# EAGLE design trig4_board (EAGLE 9.2.0)
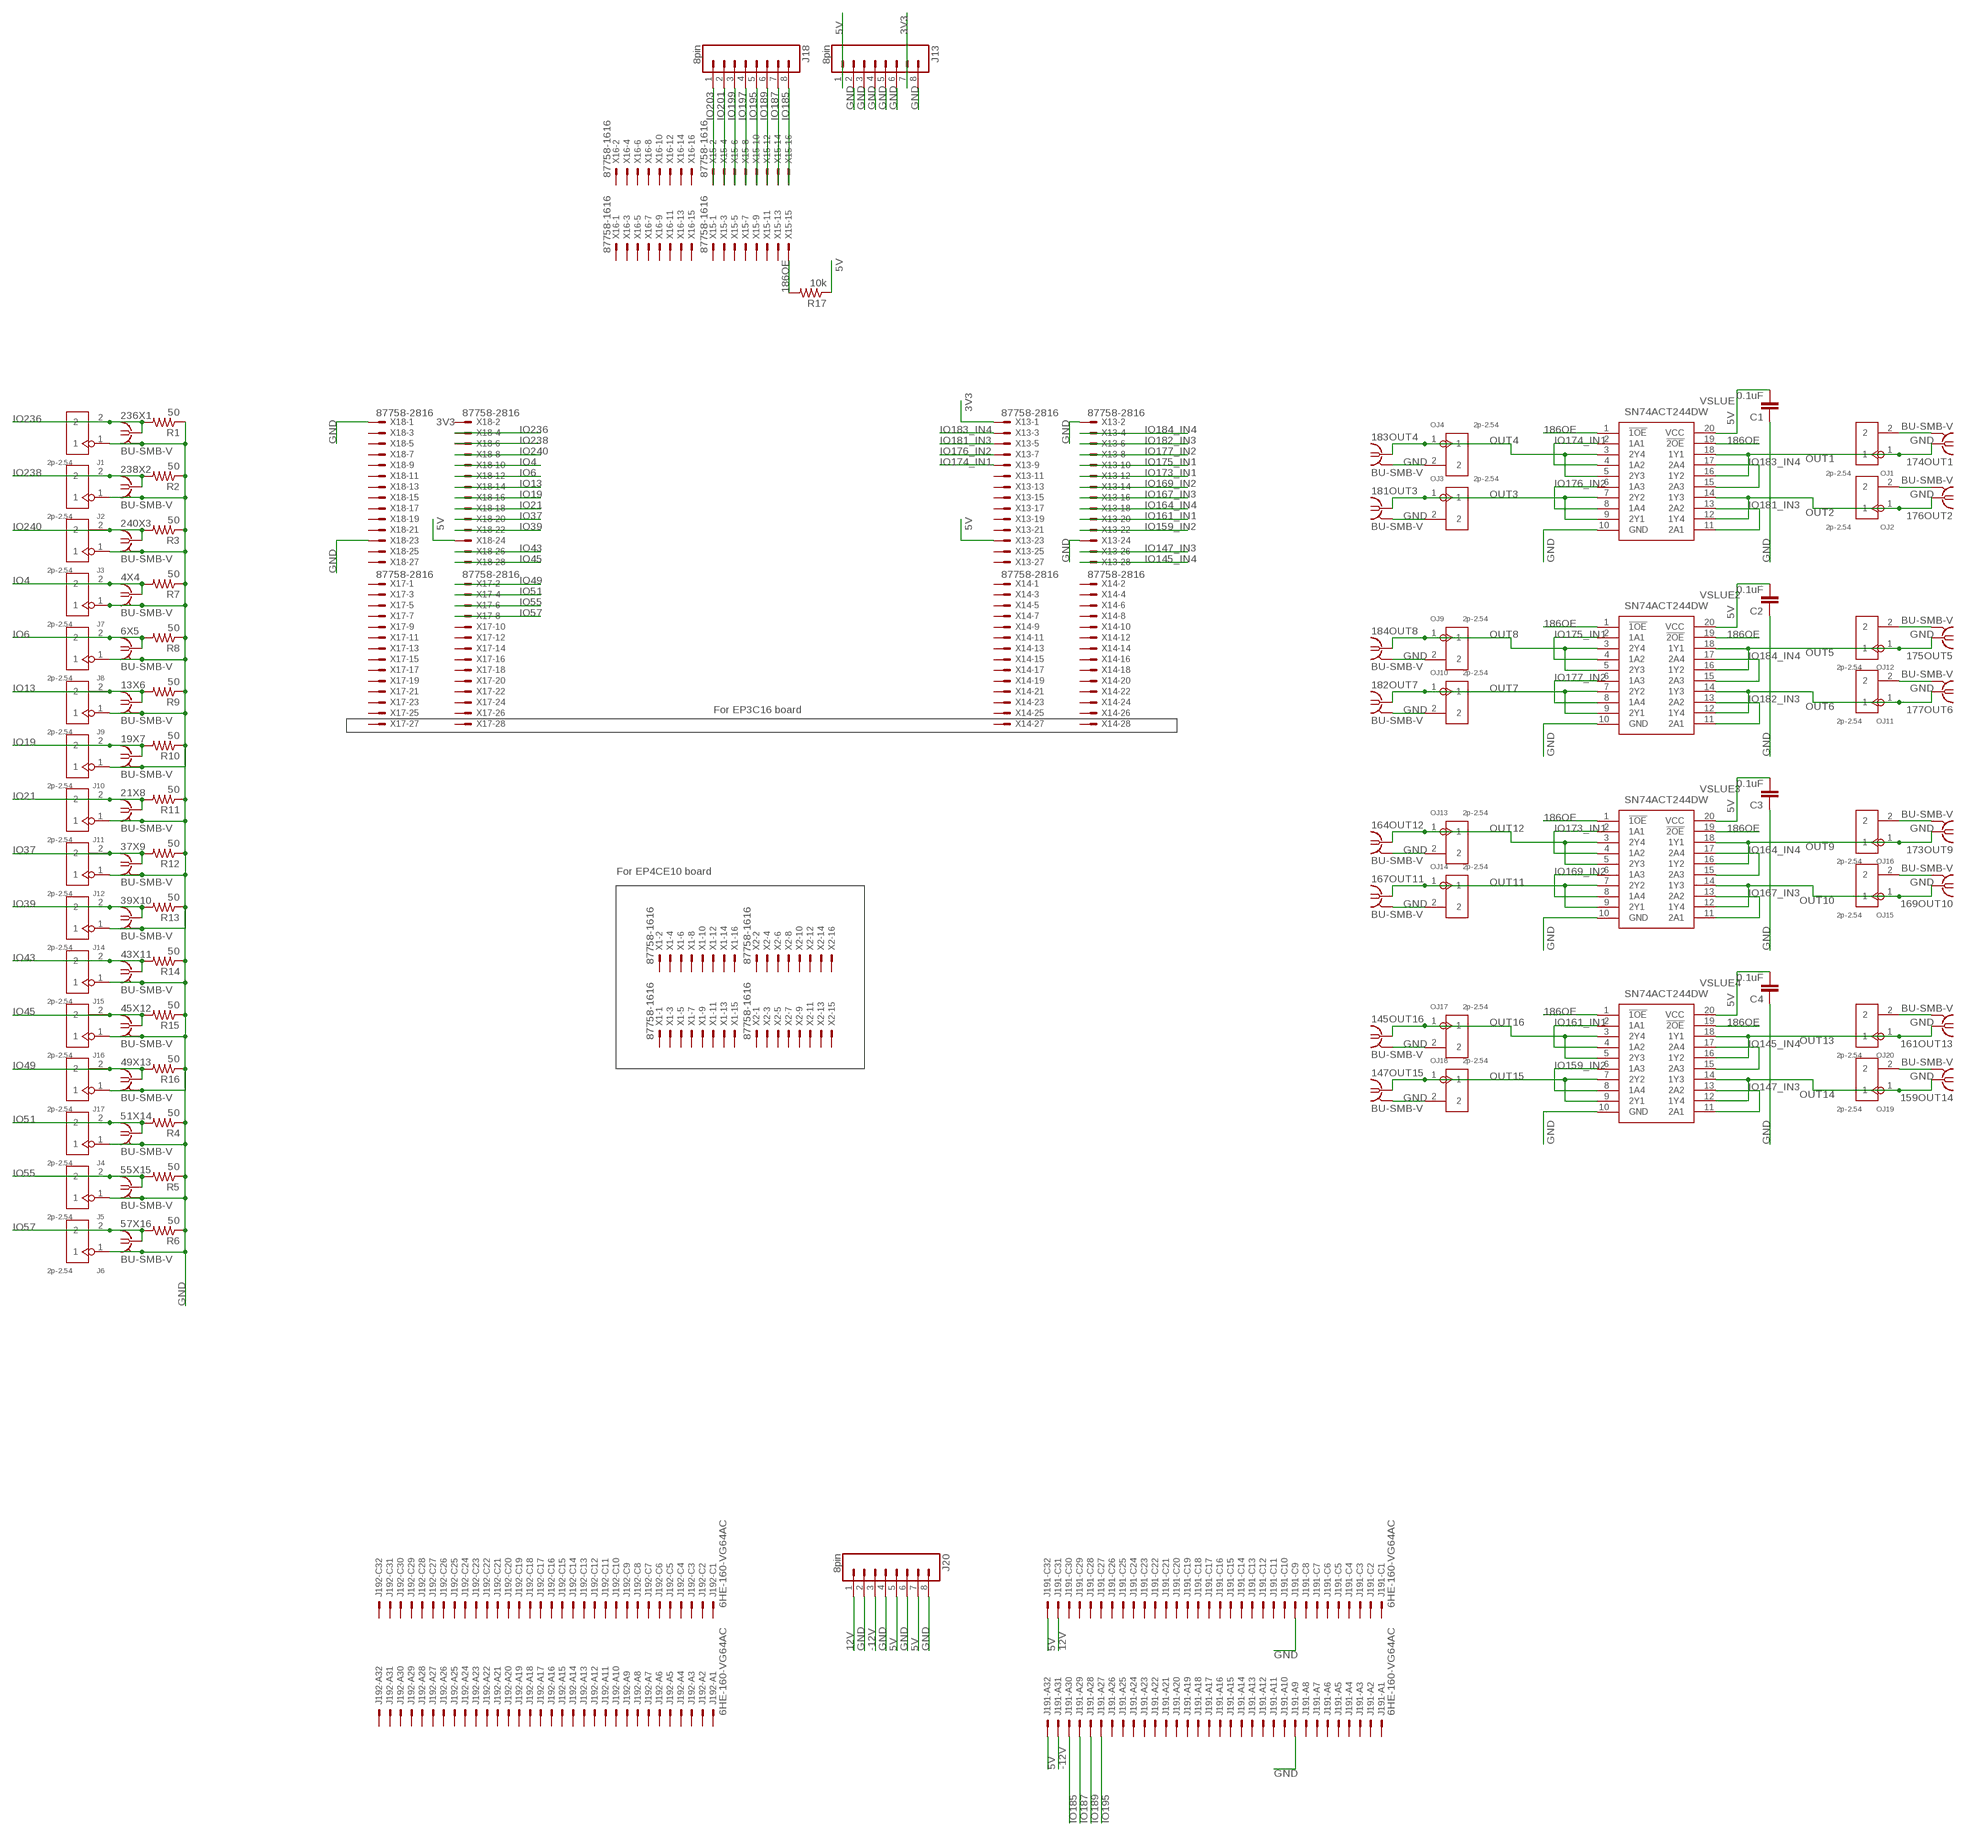
[diagram p0: schematic, sheet 1]

## Parts
4X4  BU-SMB-V  [BU-SMB-V]
6X5  BU-SMB-V  [BU-SMB-V]
13X6  BU-SMB-V  [BU-SMB-V]
19X7  BU-SMB-V  [BU-SMB-V]
21X8  BU-SMB-V  [BU-SMB-V]
37X9  BU-SMB-V  [BU-SMB-V]
39X10  BU-SMB-V  [BU-SMB-V]
43X11  BU-SMB-V  [BU-SMB-V]
45X12  BU-SMB-V  [BU-SMB-V]
49X13  BU-SMB-V  [BU-SMB-V]
51X14  BU-SMB-V  [BU-SMB-V]
55X15  BU-SMB-V  [BU-SMB-V]
57X16  BU-SMB-V  [BU-SMB-V]
145OUT16  BU-SMB-V  [BU-SMB-V]
147OUT15  BU-SMB-V  [BU-SMB-V]
159OUT14  BU-SMB-V  [BU-SMB-V]
161OUT13  BU-SMB-V  [BU-SMB-V]
164OUT12  BU-SMB-V  [BU-SMB-V]
167OUT11  BU-SMB-V  [BU-SMB-V]
169OUT10  BU-SMB-V  [BU-SMB-V]
173OUT9  BU-SMB-V  [BU-SMB-V]
174OUT1  BU-SMB-V  [BU-SMB-V]
175OUT5  BU-SMB-V  [BU-SMB-V]
176OUT2  BU-SMB-V  [BU-SMB-V]
177OUT6  BU-SMB-V  [BU-SMB-V]
181OUT3  BU-SMB-V  [BU-SMB-V]
182OUT7  BU-SMB-V  [BU-SMB-V]
183OUT4  BU-SMB-V  [BU-SMB-V]
184OUT8  BU-SMB-V  [BU-SMB-V]
236X1  BU-SMB-V  [BU-SMB-V]
238X2  BU-SMB-V  [BU-SMB-V]
240X3  BU-SMB-V  [BU-SMB-V]
C1  0.1uF  CAP0805  [0805]
C2  0.1uF  CAP0805  [0805]
C3  0.1uF  CAP0805  [0805]
C4  0.1uF  CAP0805  [0805]
J1  2p-2.54  DIP-BLACK-MALE-HEADER-VERT(2P-2.54)  [H2-2.54]
J2  2p-2.54  DIP-BLACK-MALE-HEADER-VERT(2P-2.54)  [H2-2.54]
J3  2p-2.54  DIP-BLACK-MALE-HEADER-VERT(2P-2.54)  [H2-2.54]
J4  2p-2.54  DIP-BLACK-MALE-HEADER-VERT(2P-2.54)  [H2-2.54]
J5  2p-2.54  DIP-BLACK-MALE-HEADER-VERT(2P-2.54)  [H2-2.54]
J6  2p-2.54  DIP-BLACK-MALE-HEADER-VERT(2P-2.54)  [H2-2.54]
J7  2p-2.54  DIP-BLACK-MALE-HEADER-VERT(2P-2.54)  [H2-2.54]
J8  2p-2.54  DIP-BLACK-MALE-HEADER-VERT(2P-2.54)  [H2-2.54]
J9  2p-2.54  DIP-BLACK-MALE-HEADER-VERT(2P-2.54)  [H2-2.54]
J10  2p-2.54  DIP-BLACK-MALE-HEADER-VERT(2P-2.54)  [H2-2.54]
J11  2p-2.54  DIP-BLACK-MALE-HEADER-VERT(2P-2.54)  [H2-2.54]
J12  2p-2.54  DIP-BLACK-MALE-HEADER-VERT(2P-2.54)  [H2-2.54]
J13  8pin  CONN_08"  [1X08]
J14  2p-2.54  DIP-BLACK-MALE-HEADER-VERT(2P-2.54)  [H2-2.54]
J15  2p-2.54  DIP-BLACK-MALE-HEADER-VERT(2P-2.54)  [H2-2.54]
J16  2p-2.54  DIP-BLACK-MALE-HEADER-VERT(2P-2.54)  [H2-2.54]
J17  2p-2.54  DIP-BLACK-MALE-HEADER-VERT(2P-2.54)  [H2-2.54]
J18  8pin  CONN_08"  [1X08]
J19  6HE-160-VG64AC  [6HE_160-VG64AC]
J20  8pin  CONN_08"  [1X08]
OJ1  2p-2.54  DIP-BLACK-MALE-HEADER-VERT(2P-2.54)  [H2-2.54]
OJ2  2p-2.54  DIP-BLACK-MALE-HEADER-VERT(2P-2.54)  [H2-2.54]
OJ3  2p-2.54  DIP-BLACK-MALE-HEADER-VERT(2P-2.54)  [H2-2.54]
OJ4  2p-2.54  DIP-BLACK-MALE-HEADER-VERT(2P-2.54)  [H2-2.54]
OJ9  2p-2.54  DIP-BLACK-MALE-HEADER-VERT(2P-2.54)  [H2-2.54]
OJ10  2p-2.54  DIP-BLACK-MALE-HEADER-VERT(2P-2.54)  [H2-2.54]
OJ11  2p-2.54  DIP-BLACK-MALE-HEADER-VERT(2P-2.54)  [H2-2.54]
OJ12  2p-2.54  DIP-BLACK-MALE-HEADER-VERT(2P-2.54)  [H2-2.54]
OJ13  2p-2.54  DIP-BLACK-MALE-HEADER-VERT(2P-2.54)  [H2-2.54]
OJ14  2p-2.54  DIP-BLACK-MALE-HEADER-VERT(2P-2.54)  [H2-2.54]
OJ15  2p-2.54  DIP-BLACK-MALE-HEADER-VERT(2P-2.54)  [H2-2.54]
OJ16  2p-2.54  DIP-BLACK-MALE-HEADER-VERT(2P-2.54)  [H2-2.54]
OJ17  2p-2.54  DIP-BLACK-MALE-HEADER-VERT(2P-2.54)  [H2-2.54]
OJ18  2p-2.54  DIP-BLACK-MALE-HEADER-VERT(2P-2.54)  [H2-2.54]
OJ19  2p-2.54  DIP-BLACK-MALE-HEADER-VERT(2P-2.54)  [H2-2.54]
OJ20  2p-2.54  DIP-BLACK-MALE-HEADER-VERT(2P-2.54)  [H2-2.54]
R1  50  RESISTORAXIAL-0.3  [AXIAL-0.3]
R2  50  RESISTORAXIAL-0.3  [AXIAL-0.3]
R3  50  RESISTORAXIAL-0.3  [AXIAL-0.3]
R4  50  RESISTORAXIAL-0.3  [AXIAL-0.3]
R5  50  RESISTORAXIAL-0.3  [AXIAL-0.3]
R6  50  RESISTORAXIAL-0.3  [AXIAL-0.3]
R7  50  RESISTORAXIAL-0.3  [AXIAL-0.3]
R8  50  RESISTORAXIAL-0.3  [AXIAL-0.3]
R9  50  RESISTORAXIAL-0.3  [AXIAL-0.3]
R10  50  RESISTORAXIAL-0.3  [AXIAL-0.3]
R11  50  RESISTORAXIAL-0.3  [AXIAL-0.3]
R12  50  RESISTORAXIAL-0.3  [AXIAL-0.3]
R13  50  RESISTORAXIAL-0.3  [AXIAL-0.3]
R14  50  RESISTORAXIAL-0.3  [AXIAL-0.3]
R15  50  RESISTORAXIAL-0.3  [AXIAL-0.3]
R16  50  RESISTORAXIAL-0.3  [AXIAL-0.3]
R17  10k  RESISTORAXIAL-0.3  [AXIAL-0.3]
VSLUE  SN74ACT244DW  [SOIC127P1030X265-20N]
VSLUE2  SN74ACT244DW  [SOIC127P1030X265-20N]
VSLUE3  SN74ACT244DW  [SOIC127P1030X265-20N]
VSLUE4  SN74ACT244DW  [SOIC127P1030X265-20N]
X1  87758-1616  [87758-1616]
X2  87758-1616  [87758-1616]
X13  87758-2816  [87758-2816]
X14  87758-2816  [87758-2816]
X15  87758-1616  [87758-1616]
X16  87758-1616  [87758-1616]
X17  87758-2816  [87758-2816]
X18  87758-2816  [87758-2816]

## Nets
3V3 [power]: J13.7 X13.1
5V [power]: C1.2 C2.2 C3.2 C4.2 J13.1 J19.1-A32 J19.1-C32 J20.5 J20.7 R17.P$1 VSLUE2.20(VCC) VSLUE3.20(VCC) VSLUE4.20(VCC) VSLUE.20(VCC) X13.23 X18.24
12V [power]: J19.1-C31 J20.1
186OE: R17.P$2 VSLUE2.1(!1OE) VSLUE2.19(!2OE) VSLUE3.1(!1OE) VSLUE3.19(!2OE) VSLUE4.1(!1OE) VSLUE4.19(!2OE) VSLUE.1(!1OE) VSLUE.19(!2OE) X15.15
-12V [power]: J19.1-A31 J20.3
GND: 4X4.2 4X4.3 4X4.4 4X4.5 6X5.2 6X5.3 6X5.4 6X5.5 13X6.2 13X6.3 13X6.4 13X6.5 19X7.2 19X7.3 19X7.4 19X7.5 21X8.2 21X8.3 21X8.4 21X8.5 37X9.2 37X9.3 37X9.4 37X9.5 39X10.2 39X10.3 39X10.4 39X10.5 43X11.2 43X11.3 43X11.4 43X11.5 45X12.2 45X12.3 45X12.4 45X12.5 49X13.2 49X13.3 49X13.4 49X13.5 51X14.2 51X14.3 51X14.4 51X14.5 55X15.2 55X15.3 55X15.4 55X15.5 57X16.2 57X16.3 57X16.4 57X16.5 145OUT16.2 145OUT16.3 145OUT16.4 145OUT16.5 147OUT15.2 147OUT15.3 147OUT15.4 147OUT15.5 159OUT14.2 159OUT14.3 159OUT14.4 159OUT14.5 161OUT13.2 161OUT13.3 161OUT13.4 161OUT13.5 164OUT12.2 164OUT12.3 164OUT12.4 164OUT12.5 167OUT11.2 167OUT11.3 167OUT11.4 167OUT11.5 169OUT10.2 169OUT10.3 169OUT10.4 169OUT10.5 173OUT9.2 173OUT9.3 173OUT9.4 173OUT9.5 174OUT1.2 174OUT1.3 174OUT1.4 174OUT1.5 175OUT5.2 175OUT5.3 175OUT5.4 175OUT5.5 176OUT2.2 176OUT2.3 176OUT2.4 176OUT2.5 177OUT6.2 177OUT6.3 177OUT6.4 177OUT6.5 181OUT3.2 181OUT3.3 181OUT3.4 181OUT3.5 182OUT7.2 182OUT7.3 182OUT7.4 182OUT7.5 183OUT4.2 183OUT4.3 183OUT4.4 183OUT4.5 184OUT8.2 184OUT8.3 184OUT8.4 184OUT8.5 236X1.2 236X1.3 236X1.4 236X1.5 238X2.2 238X2.3 238X2.4 238X2.5 240X3.2 240X3.3 240X3.4 240X3.5 C1.1 C2.1 C3.1 C4.1 J1.1 J2.1 J3.1 J4.1 J5.1 J6.1 J7.1 J8.1 J9.1 J10.1 J11.1 J12.1 J13.2 J13.3 J13.4 J13.5 J13.6 J13.8 J14.1 J15.1 J16.1 J17.1 J19.1-A9 J19.1-C9 J20.2 J20.4 J20.6 J20.8 OJ1.2 OJ2.2 OJ3.2 OJ4.2 OJ9.2 OJ10.2 OJ11.2 OJ12.2 OJ13.2 OJ14.2 OJ15.2 OJ16.2 OJ17.2 OJ18.2 OJ19.2 OJ20.2 R1.P$1 R2.P$1 R3.P$1 R4.P$1 R5.P$1 R6.P$1 R7.P$1 R8.P$1 R9.P$1 R10.P$1 R11.P$1 R12.P$1 R13.P$1 R14.P$1 R15.P$1 R16.P$1 VSLUE2.10(GND) VSLUE3.10(GND) VSLUE4.10(GND) VSLUE.10(GND) X13.2 X13.24 X18.1 X18.23
IO4: 4X4.1 J7.2 R7.P$2 X18.10
IO6: 6X5.1 J8.2 R8.P$2 X18.12
IO13: 13X6.1 J9.2 R9.P$2 X18.14
IO19: 19X7.1 J10.2 R10.P$2 X18.16
IO21: 21X8.1 J11.2 R11.P$2 X18.18
IO37: 37X9.1 J12.2 R12.P$2 X18.20
IO39: 39X10.1 J14.2 R13.P$2 X18.22
IO43: 43X11.1 J15.2 R14.P$2 X18.26
IO45: 45X12.1 J16.2 R15.P$2 X18.28
IO49: 49X13.1 J17.2 R16.P$2 X17.2
IO51: 51X14.1 J4.2 R4.P$2 X17.4
IO55: 55X15.1 J5.2 R5.P$2 X17.6
IO57: 57X16.1 J6.2 R6.P$2 X17.8
IO145_IN4: VSLUE4.15(2A3) VSLUE4.17(2A4) X13.28
IO147_IN3: VSLUE4.11(2A1) VSLUE4.13(2A2) X13.26
IO159_IN2: VSLUE4.6(1A3) VSLUE4.8(1A4) X13.22
IO161_IN1: VSLUE4.2(1A1) VSLUE4.4(1A2) X13.20
IO164_IN4: VSLUE3.15(2A3) VSLUE3.17(2A4) X13.18
IO167_IN3: VSLUE3.11(2A1) VSLUE3.13(2A2) X13.16
IO169_IN2: VSLUE3.6(1A3) VSLUE3.8(1A4) X13.14
IO173_IN1: VSLUE3.2(1A1) VSLUE3.4(1A2) X13.12
IO174_IN1: VSLUE.2(1A1) VSLUE.4(1A2) X13.9
IO175_IN1: VSLUE2.2(1A1) VSLUE2.4(1A2) X13.10
IO176_IN2: VSLUE.6(1A3) VSLUE.8(1A4) X13.7
IO177_IN2: VSLUE2.6(1A3) VSLUE2.8(1A4) X13.8
IO181_IN3: VSLUE.11(2A1) VSLUE.13(2A2) X13.5
IO182_IN3: VSLUE2.11(2A1) VSLUE2.13(2A2) X13.6
IO183_IN4: VSLUE.15(2A3) VSLUE.17(2A4) X13.3
IO184_IN4: VSLUE2.15(2A3) VSLUE2.17(2A4) X13.4
IO185: J18.8 J19.1-A30 X15.16
IO187: J18.7 J19.1-A29 X15.14
IO189: J18.6 J19.1-A28 X15.12
IO195: J18.5 J19.1-A27 X15.10
IO197: J18.4 X15.8
IO199: J18.3 X15.6
IO201: J18.2 X15.4
IO203: J18.1 X15.2
IO236: 236X1.1 J1.2 R1.P$2 X18.4
IO238: 238X2.1 J2.2 R2.P$2 X18.6
IO240: 240X3.1 J3.2 R3.P$2 X18.8
OUT1: 174OUT1.1 OJ1.1 VSLUE.16(1Y2) VSLUE.18(1Y1)
OUT2: 176OUT2.1 OJ2.1 VSLUE.12(1Y4) VSLUE.14(1Y3)
OUT3: 181OUT3.1 OJ3.1 VSLUE.7(2Y2) VSLUE.9(2Y1)
OUT4: 183OUT4.1 OJ4.1 VSLUE.3(2Y4) VSLUE.5(2Y3)
OUT5: 175OUT5.1 OJ12.1 VSLUE2.16(1Y2) VSLUE2.18(1Y1)
OUT6: 177OUT6.1 OJ11.1 VSLUE2.12(1Y4) VSLUE2.14(1Y3)
OUT7: 182OUT7.1 OJ10.1 VSLUE2.7(2Y2) VSLUE2.9(2Y1)
OUT8: 184OUT8.1 OJ9.1 VSLUE2.3(2Y4) VSLUE2.5(2Y3)
OUT9: 173OUT9.1 OJ16.1 VSLUE3.16(1Y2) VSLUE3.18(1Y1)
OUT10: 169OUT10.1 OJ15.1 VSLUE3.12(1Y4) VSLUE3.14(1Y3)
OUT11: 167OUT11.1 OJ14.1 VSLUE3.7(2Y2) VSLUE3.9(2Y1)
OUT12: 164OUT12.1 OJ13.1 VSLUE3.3(2Y4) VSLUE3.5(2Y3)
OUT13: 161OUT13.1 OJ20.1 VSLUE4.16(1Y2) VSLUE4.18(1Y1)
OUT14: 159OUT14.1 OJ19.1 VSLUE4.12(1Y4) VSLUE4.14(1Y3)
OUT15: 147OUT15.1 OJ18.1 VSLUE4.7(2Y2) VSLUE4.9(2Y1)
OUT16: 145OUT16.1 OJ17.1 VSLUE4.3(2Y4) VSLUE4.5(2Y3)
Unconnected: J19.1-A1 J19.1-A2 J19.1-A3 J19.1-A4 J19.1-A5 J19.1-A6 J19.1-A7 J19.1-A8 J19.1-A10 J19.1-A11 J19.1-A12 J19.1-A13 J19.1-A14 J19.1-A15 J19.1-A16 J19.1-A17 J19.1-A18 J19.1-A19 J19.1-A20 J19.1-A21 J19.1-A22 J19.1-A23 J19.1-A24 J19.1-A25 J19.1-A26 J19.1-C1 J19.1-C2 J19.1-C3 J19.1-C4 J19.1-C5 J19.1-C6 J19.1-C7 J19.1-C8 J19.1-C10 J19.1-C11 J19.1-C12 J19.1-C13 J19.1-C14 J19.1-C15 J19.1-C16 J19.1-C17 J19.1-C18 J19.1-C19 J19.1-C20 J19.1-C21 J19.1-C22 J19.1-C23 J19.1-C24 J19.1-C25 J19.1-C26 J19.1-C27 J19.1-C28 J19.1-C29 J19.1-C30 J19.2-A1 J19.2-A2 J19.2-A3 J19.2-A4 J19.2-A5 J19.2-A6 J19.2-A7 J19.2-A8 J19.2-A9 J19.2-A10 J19.2-A11 J19.2-A12 J19.2-A13 J19.2-A14 J19.2-A15 J19.2-A16 J19.2-A17 J19.2-A18 J19.2-A19 J19.2-A20 J19.2-A21 J19.2-A22 J19.2-A23 J19.2-A24 J19.2-A25 J19.2-A26 J19.2-A27 J19.2-A28 J19.2-A29 J19.2-A30 J19.2-A31 J19.2-A32 J19.2-C1 J19.2-C2 J19.2-C3 J19.2-C4 J19.2-C5 J19.2-C6 J19.2-C7 J19.2-C8 J19.2-C9 J19.2-C10 J19.2-C11 J19.2-C12 J19.2-C13 J19.2-C14 J19.2-C15 J19.2-C16 J19.2-C17 J19.2-C18 J19.2-C19 J19.2-C20 J19.2-C21 J19.2-C22 J19.2-C23 J19.2-C24 J19.2-C25 J19.2-C26 J19.2-C27 J19.2-C28 J19.2-C29 J19.2-C30 J19.2-C31 J19.2-C32 X1.1 X1.2 X1.3 X1.4 X1.5 X1.6 X1.7 X1.8 X1.9 X1.10 X1.11 X1.12 X1.13 X1.14 X1.15 X1.16 X2.1 X2.2 X2.3 X2.4 X2.5 X2.6 X2.7 X2.8 X2.9 X2.10 X2.11 X2.12 X2.13 X2.14 X2.15 X2.16 X13.11 X13.13 X13.15 X13.17 X13.19 X13.21 X13.25 X13.27 X14.1 X14.2 X14.3 X14.4 X14.5 X14.6 X14.7 X14.8 X14.9 X14.10 X14.11 X14.12 X14.13 X14.14 X14.15 X14.16 X14.17 X14.18 X14.19 X14.20 X14.21 X14.22 X14.23 X14.24 X14.25 X14.26 X14.27 X14.28 X15.1 X15.3 X15.5 X15.7 X15.9 X15.11 X15.13 X16.1 X16.2 X16.3 X16.4 X16.5 X16.6 X16.7 X16.8 X16.9 X16.10 X16.11 X16.12 X16.13 X16.14 X16.15 X16.16 X17.1 X17.3 X17.5 X17.7 X17.9 X17.10 X17.11 X17.12 X17.13 X17.14 X17.15 X17.16 X17.17 X17.18 X17.19 X17.20 X17.21 X17.22 X17.23 X17.24 X17.25 X17.26 X17.27 X17.28 X18.2 X18.3 X18.5 X18.7 X18.9 X18.11 X18.13 X18.15 X18.17 X18.19 X18.21 X18.25 X18.27

## Notes on the sheet
- 3V3
- For EP3C16 board
- For EP4CE10 board

## Library data of the parts
4X4 6X5 13X6 19X7 21X8 37X9 39X10 43X11 45X12 49X13 51X14 55X15 57X16 145OUT16 147OUT15 159OUT14 161OUT13 164OUT12 167OUT11 169OUT10 173OUT9 174OUT1 175OUT5 176OUT2 177OUT6 181OUT3 182OUT7 183OUT4 184OUT8 236X1 238X2 240X3 = con-coax:BU-SMB-V: FEMALE SMB CONNECTOR Radiall distributor RS 112-2993; OC_FARNELL: unknown; OC_NEWARK: unknown
C1-C4 = SparkFun-Capacitors:CAP: Capacitor Standard 0603 ceramic capacitor, and 0.1" leaded capacitor.
J1-J12 J14-J17 OJ1-OJ4 OJ9-OJ20 = Seeed-Connector:DIP-BLACK-MALE-HEADER-VERT(2P-2.54): 320020016; MPN: P125-1102A0BS116A1
J13 J18 J20 = SparkFun-Connectors:CONN_08: Multi connection point. Often used as Generic Header-pin footprint for 0.1 inch spaced/style header connections On any of the 0.1 inch spaced packages, you can populate with these: Break Away Headers - Straight <https://www.sparkfun.com/products/116> (PRT-00116) Break Away Male Headers - Right Angle <https://www.sparkfun.com/products/553> (PRT-00553) Female Headers <https://www.sparkfun.com/products/115> (PRT-00115) Break Away Headers - Machine Pin <https://www.sparkfun.com/products/117> (PRT-00117) Break Away Female Headers - Swiss Machine Pin <https://www.sparkfun.com/products/743> (PRT-00743) Arduino Stackable Header - 8 Pin <https://www.sparkfun.com/products/9279> (PRT-09279) For SCREWTERMINALS and SPRING TERMINALS visit here: Screw Terimnals on SparkFun.com <https://www.sparkfun.com/search/results?term=Screw+Terminals> (5mm/3.5mm/2.54mm spacing) This device is also useful as a general connection point to wire up your design to another part of your project. Our various solder wires solder well into these plated through hole pads. Hook-Up Wire - Assortment (Stranded, 22 AWG) <https://www.sparkfun.com/products/11375> (PRT-11375) Hook-Up Wire - Assortment (Solid Core, 22 AWG) <https://www.sparkfun.com/products/11367> (PRT-11367) View the entire wire category on our website here <https://www.sparkfun.com/categories/141> Special notes: Molex polarized connector foot print use with SKU : PRT-08231 with associated crimp pins and housings. 1MM SMD Version SKU: PRT-10208 NOTES ON THE VARIANTS LOCK and LOCK_LONGPADS... This footprint was designed to help hold the alignment of a through-hole component (i.e. 6-pin header) while soldering it into place. You may notice that each hole has been shifted either up or down by 0.005 of an inch from it's more standard position (which is a perfectly straight line). This slight alteration caused the pins (the squares in the middle) to touch the edges of the holes. Because they are alternating, it causes a "brace" to hold the component in place. 0.005 has proven to be the perfect amount of "off-center" position when using our standard breakaway headers. Although looks a little odd when you look at the bare footprint, once you have a header in there, the alteration is very hard to notice. Also,if you push a header all the way into place, it is covered up entirely on the bottom side.; PROD_ID: CONN-08438
J19 = 19inch:6HE-?-VG64AC: Euro Card with 2 x VG-64 AC connector
R1-R17 = SparkFun-Passives:RESISTOR: Resistor Basic schematic elements and footprints for 0603, 1206, and PTH resistors.
VSLUE VSLUE2-VSLUE4 = SN74ACT244DW:SN74ACT244DW: SN74ACT244DW, 8-Bit Buffer, Line Driver, ACT, 3-State Non-Inverting 4.5 5.5 V 20-Pin SOIC Source: Datasheet <http://www.ti.com/lit/ds/symlink/sn74act244.pdf>; ARROW_PART_NUMBER: SN74ACT244DW; ARROW_PRICE-STOCK: https://www.arrow.com/en/products/sn74act244dw/texas-instruments; DESCRIPTION: SN74ACT244DW, 8-Bit Buffer, Line Driver, ACT, 3-State Non-Inverting 4.5 5.5 V 20-Pin SOIC; HEIGHT: 2.65mm; MANUFACTURER_NAME: Texas Instruments; MANUFACTURER_PART_NUMBER: SN74ACT244DW; RS_PART_NUMBER: 4363169; RS_PRICE-STOCK: http://uk.rs-online.com/web/p/products/4363169
X1 X2 X15 X16 = con-molex:87758-1616: 16 Pin - 2mm Dual Row Single Wafer, Vertical T/H HDR Source: http://www.molex.com/pdm_docs/sd/877580616_sd.pdf; MF: MOLEX; MPN: 87758-1616; OC_FARNELL: 7472366; OC_NEWARK: 59J1563
X13 X14 X17 X18 = con-molex:87758-2816: 28 Pin - 2mm Dual Row Single Wafer, Vertical T/H HDR Source: http://www.molex.com/pdm_docs/sd/877580616_sd.pdf; MF: MOLEX; MPN: 87758-2816; OC_FARNELL: unknown; OC_NEWARK: 25M5681

## Net classes
0 default: width 0.254 mm
1 power: width 0.762 mm

## Board
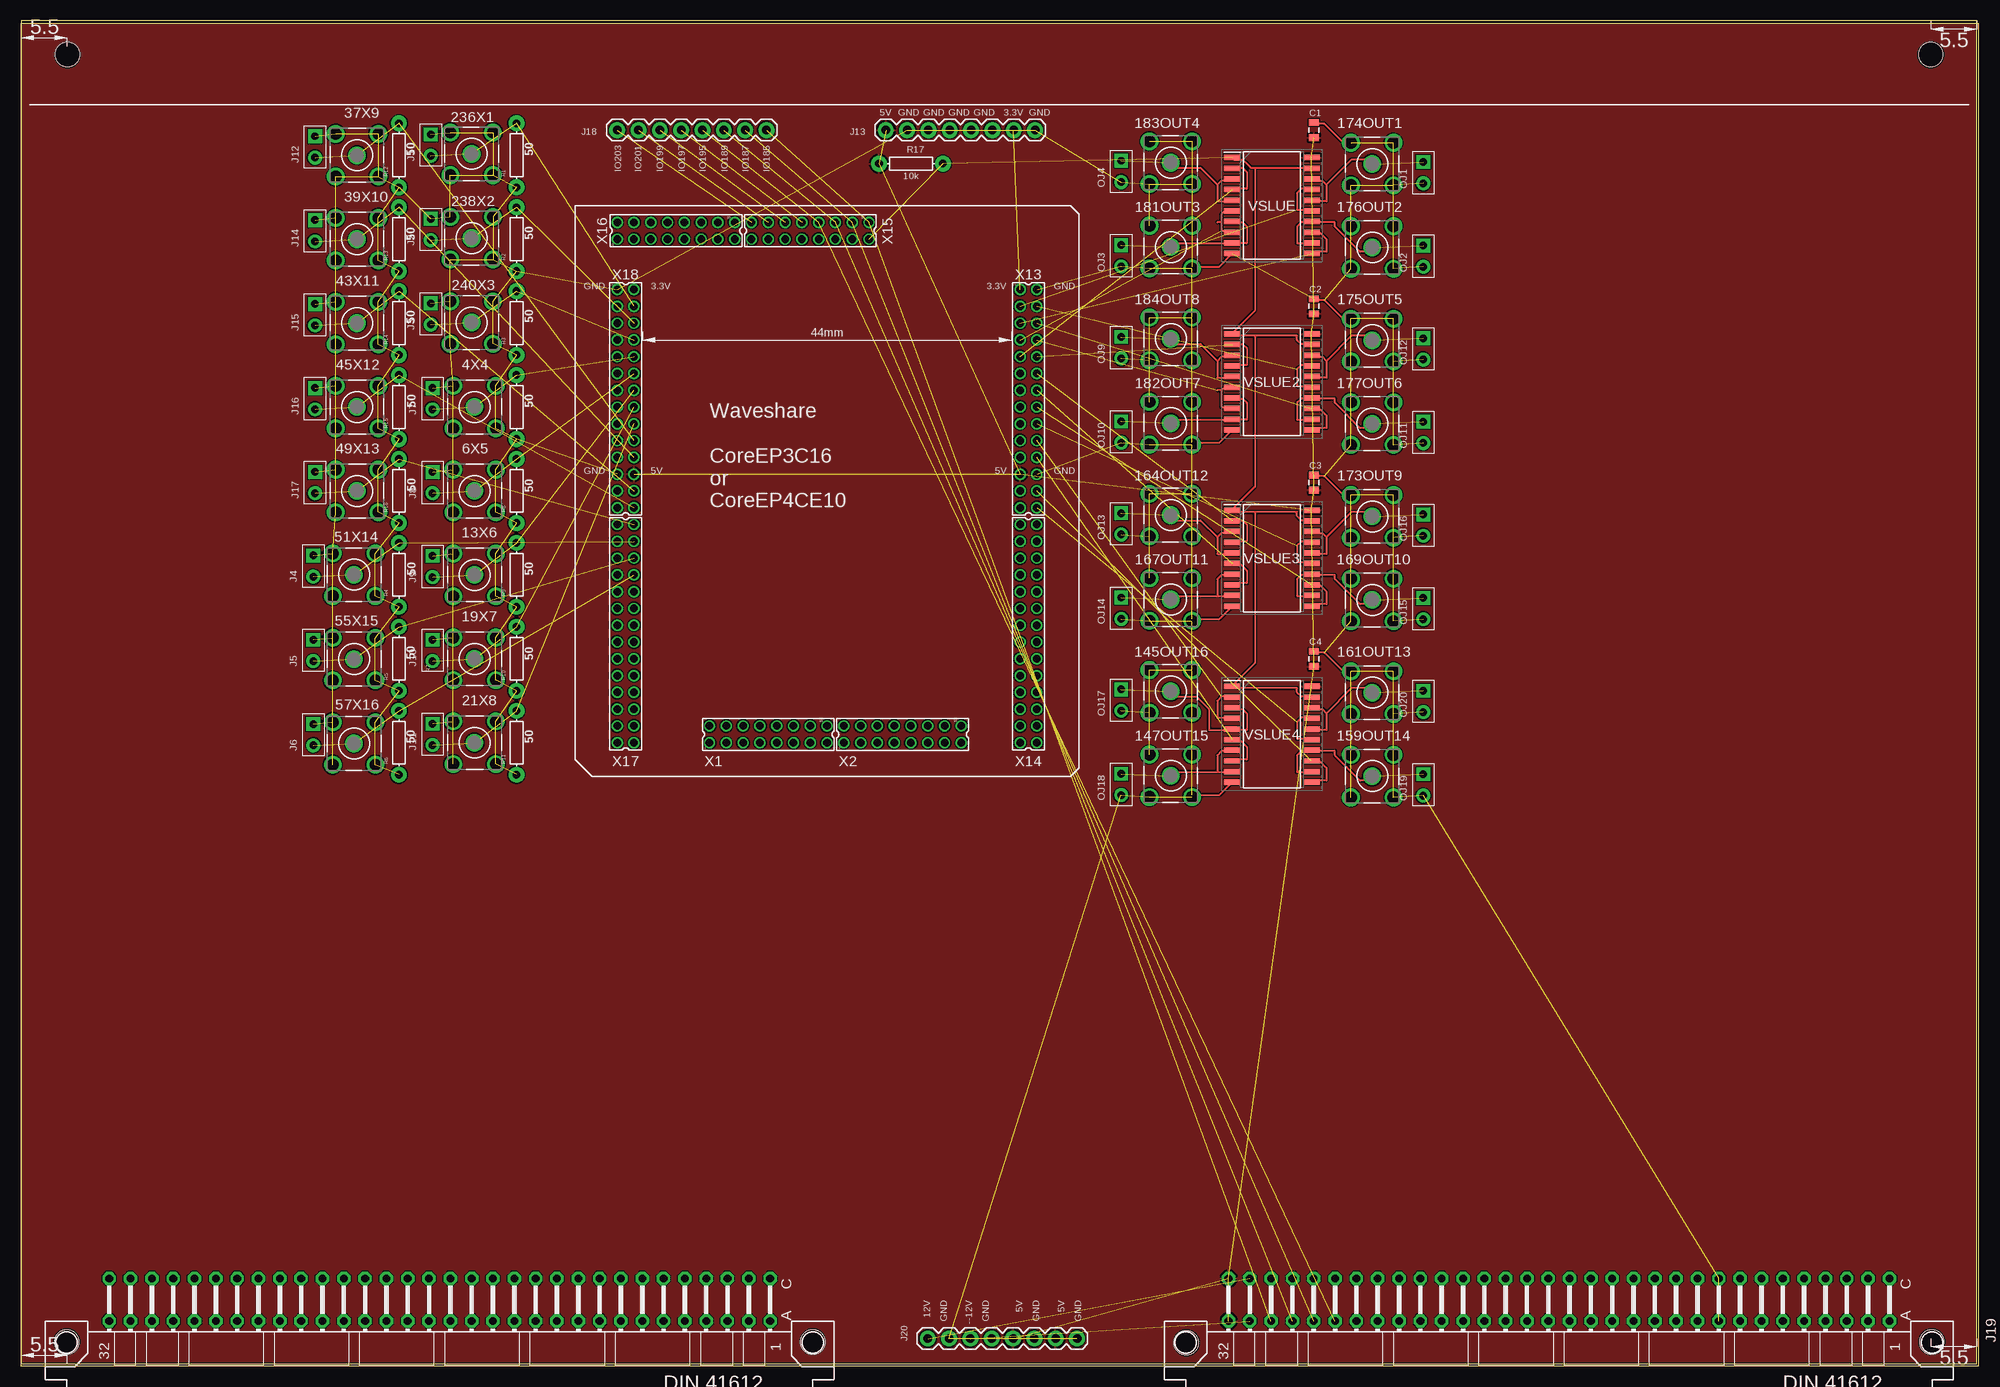
[diagram p1: board, top side]
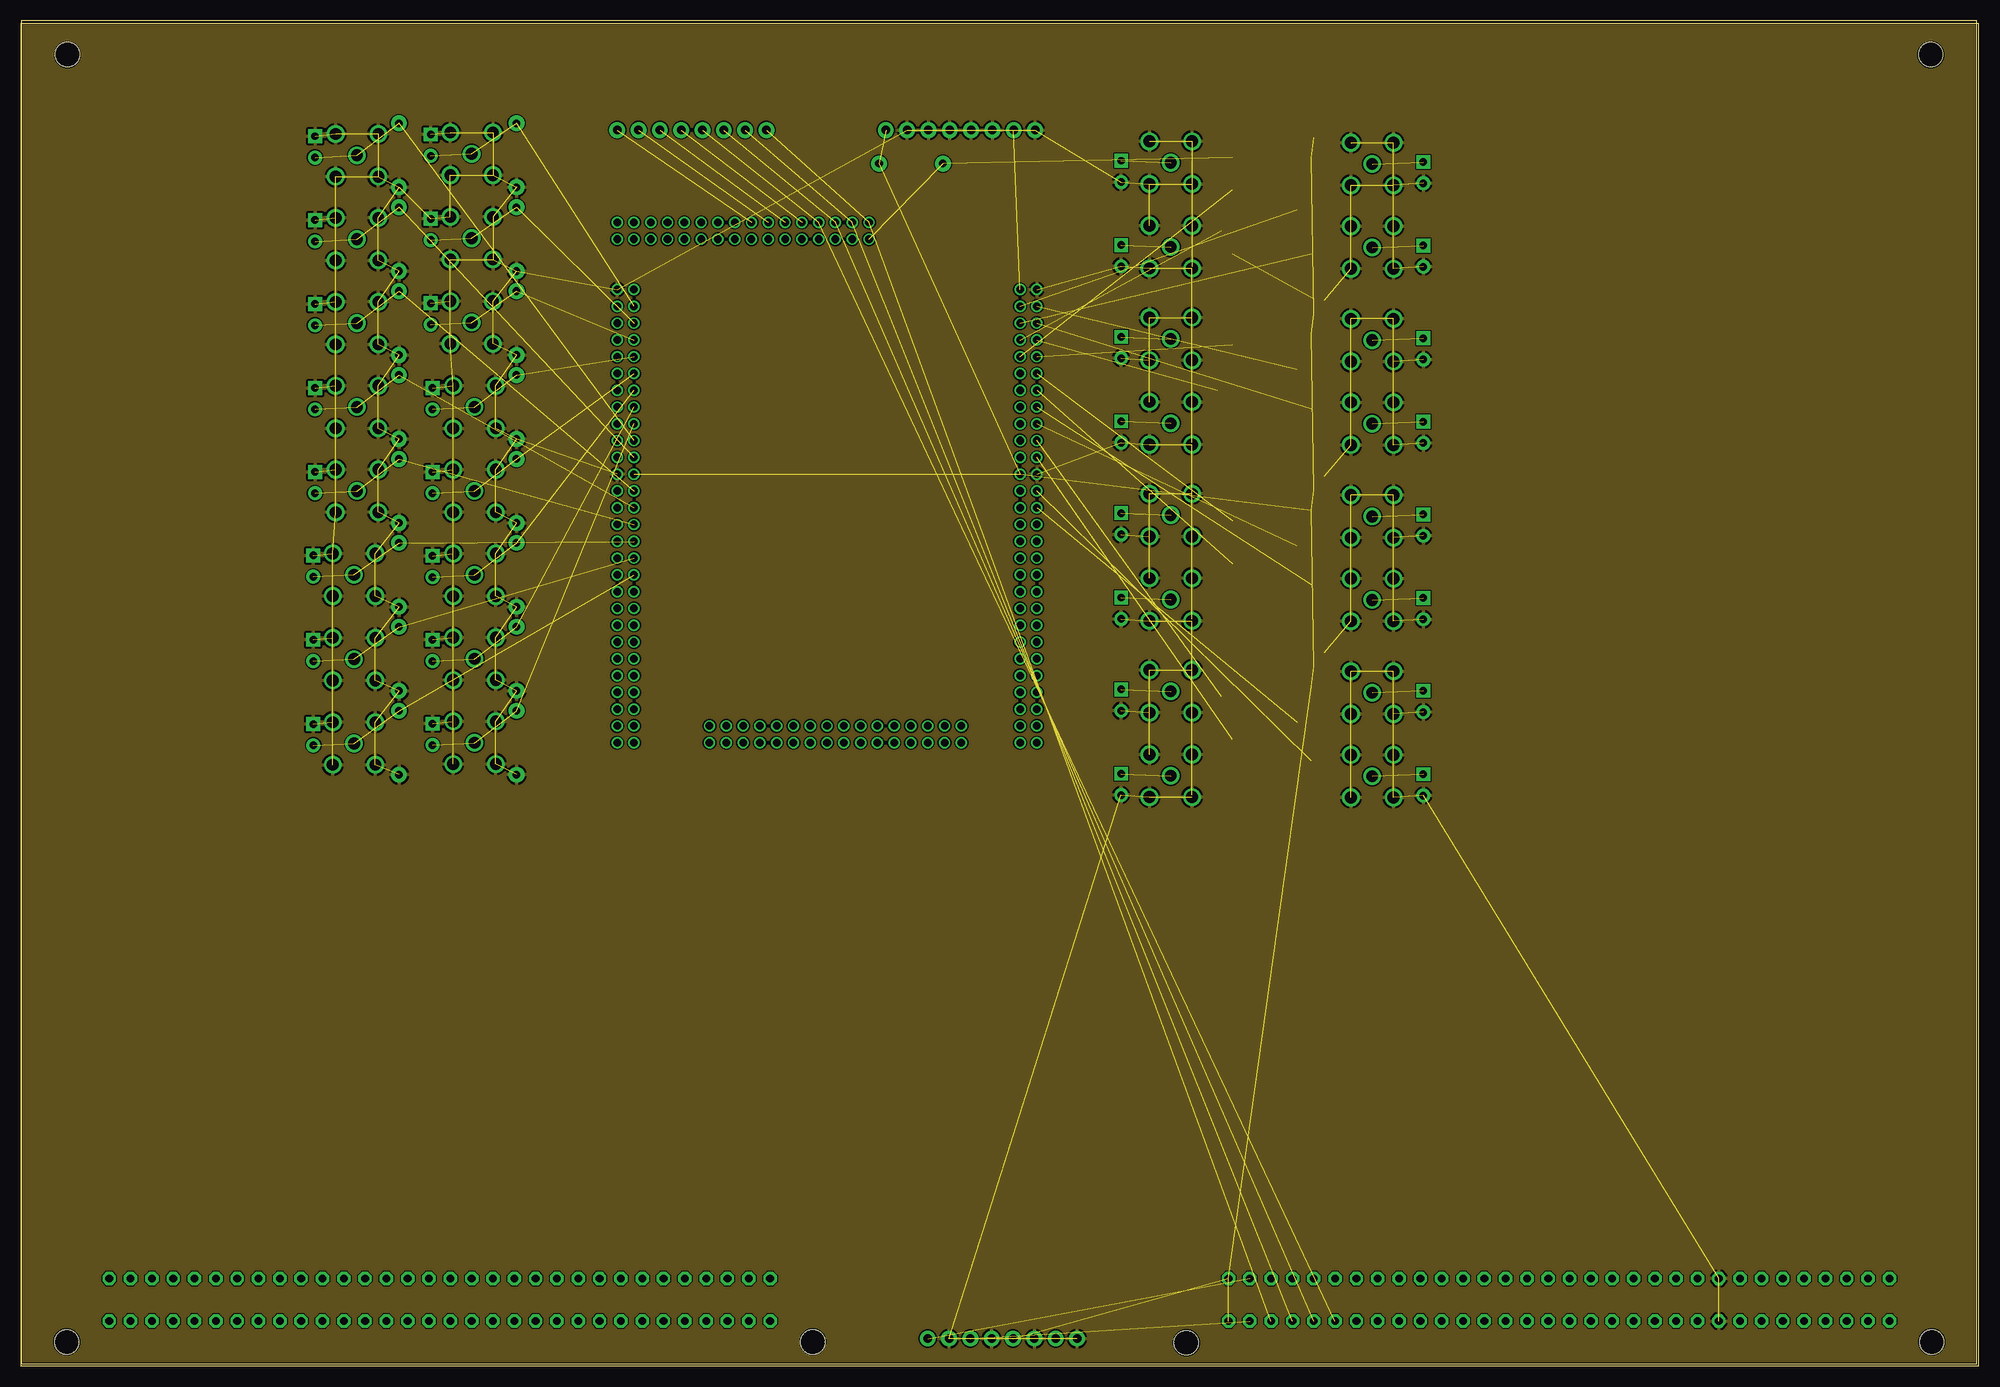
[diagram p2: board, inner layer gnd]

Size 233 x 160 mm. Coordinates in mm from the lower left corner, seen from the top.
Outline: 0,160 0,0 233,0 233,160 0,160
Copper layers (1*2*15*16): power 0.035mm / dielectric 0.2mm / route2 0.0175mm / dielectric 0.3mm / gnd 0.0175mm / dielectric 0.2mm / route1 0.035mm
Design rules "Seeed_AllPCB_MacroFab_haas6mil": minimum track width 6mil, minimum drill 12mil, track to track 6mil, track to pad 6mil, pad to pad 6mil, via to via 6mil, smd to smd 0mil, copper to edge 6mil, drill to drill 6mil, minimum pad ring 6mil, minimum via ring 6mil, stop-mask expansion 6mil, vias tented up to drill 25mil, thermal gap 10mil
Holes 2.9 mm at 5.4,2.6 138.8,2.5 227.6,2.6 94.3,2.6 5.5,156 227.5,156

### Footprints (pad centres in the part's own frame; a part is rotated, then mirrored left to right if it is on the bottom)
BU-SMB-V = drill 1.4: 1 0,0; 2 -2.54,2.54; 3 2.54,2.54; 4 2.54,-2.54; 5 -2.54,-2.54
0805 = smd 0.8 x 1.2: 1 -0.9,0; 2 0.9,0
H2-2.54 = drill 0.889 pad 1.651 square: 1 0,1.27 | drill 0.889 pad 1.651: 2 0,-1.27
1X08 = drill 1.016 pad 1.88: 1 0,0; 2 2.54,0; 3 5.08,0; 4 7.62,0; 5 10.16,0; 6 12.7,0; 7 15.24,0; 8 17.78,0
6HE_160-VG64AC = drill 0.914 pad 1.6 octagon: 1-A1 5.08,11.43; 1-A2 5.08,16.51; 1-A3 5.08,13.97; 1-A4 5.08,19.05; 1-A5 5.08,21.59; 1-A6 5.08,24.13; 1-A7 5.08,26.67; 1-A8 5.08,29.21; 1-A9 5.08,31.75; 1-A10 5.08,34.29; 1-A11 5.08,36.83; 1-A12 5.08,39.37; 1-A13 5.08,41.91; 1-A14 5.08,44.45; 1-A15 5.08,46.99; 1-A16 5.08,49.53; 1-A17 5.08,52.07; 1-A18 5.08,54.61; 1-A19 5.08,57.15; 1-A20 5.08,59.69; 1-A21 5.08,62.23; 1-A22 5.08,64.77; 1-A23 5.08,67.31; 1-A24 5.08,69.85; 1-A25 5.08,72.39; 1-A26 5.08,74.93; 1-A27 5.08,77.47; 1-A28 5.08,80.01; 1-A29 5.08,82.55; 1-A30 5.08,85.09; 1-A31 5.08,87.63; 1-A32 5.08,90.17; 1-C1 10.16,11.43; 1-C2 10.16,13.97; 1-C3 10.16,16.51; 1-C4 10.16,19.05; 1-C5 10.16,21.59; 1-C6 10.16,24.13; 1-C7 10.16,26.67; 1-C8 10.16,29.21; 1-C9 10.16,31.75; 1-C10 10.16,34.29; 1-C11 10.16,36.83; 1-C12 10.16,39.37; 1-C13 10.16,41.91; 1-C14 10.16,44.45; 1-C15 10.16,46.99; 1-C16 10.16,49.53; 1-C17 10.16,52.07; 1-C18 10.16,54.61; 1-C19 10.16,57.15; 1-C20 10.16,59.69; 1-C21 10.16,62.23; 1-C22 10.16,64.77; 1-C23 10.16,67.31; 1-C24 10.16,69.85; 1-C25 10.16,72.39; 1-C26 10.16,74.93; 1-C27 10.16,77.47; 1-C28 10.16,80.01; 1-C29 10.16,82.55; 1-C30 10.16,85.09; 1-C31 10.16,87.63; 1-C32 10.16,90.17; 2-A1 5.08,144.78; 2-A2 5.08,147.32; 2-A3 5.08,149.86; 2-A4 5.08,152.4; 2-A5 5.08,154.94; 2-A6 5.08,157.48; 2-A7 5.08,160.02; 2-A8 5.08,162.56; 2-A9 5.08,165.1; 2-A10 5.08,167.64; 2-A11 5.08,170.18; 2-A12 5.08,172.72; 2-A13 5.08,175.26; 2-A14 5.08,177.8; 2-A15 5.08,180.34; 2-A16 5.08,182.88; 2-A17 5.08,185.42; 2-A18 5.08,187.96; 2-A19 5.08,190.5; 2-A20 5.08,193.04; 2-A21 5.08,195.58; 2-A22 5.08,198.12; 2-A23 5.08,200.66; 2-A24 5.08,203.2; 2-A25 5.08,205.74; 2-A26 5.08,208.28; 2-A27 5.08,210.82; 2-A28 5.08,213.36; 2-A29 5.08,215.9; 2-A30 5.08,218.44; 2-A31 5.08,220.98; 2-A32 5.08,223.52; 2-C1 10.16,144.78; 2-C2 10.16,147.32; 2-C3 10.16,149.86; 2-C4 10.16,152.4; 2-C5 10.16,154.94; 2-C6 10.16,157.48; 2-C7 10.16,160.02; 2-C8 10.16,162.56; 2-C9 10.16,165.1; 2-C10 10.16,167.64; 2-C11 10.16,170.18; 2-C12 10.16,172.72; 2-C13 10.16,175.26; 2-C14 10.16,177.8; 2-C15 10.16,180.34; 2-C16 10.16,182.88; 2-C17 10.16,185.42; 2-C18 10.16,187.96; 2-C19 10.16,190.5; 2-C20 10.16,193.04; 2-C21 10.16,195.58; 2-C22 10.16,198.12; 2-C23 10.16,200.66; 2-C24 10.16,203.2; 2-C25 10.16,205.74; 2-C26 10.16,208.28; 2-C27 10.16,210.82; 2-C28 10.16,213.36; 2-C29 10.16,215.9; 2-C30 10.16,218.44; 2-C31 10.16,220.98; 2-C32 10.16,223.52
AXIAL-0.3 = drill 0.9 pad 1.88: P$1 -3.81,0; P$2 3.81,0
SOIC127P1030X265-20N = smd 1.95 x 0.65: 1 -4.725,5.715; 2 -4.725,4.445; 3 -4.725,3.175; 4 -4.725,1.905; 5 -4.725,0.635; 6 -4.725,-0.635; 7 -4.725,-1.905; 8 -4.725,-3.175; 9 -4.725,-4.445; 10 -4.725,-5.715; 11 4.725,-5.715; 12 4.725,-4.445; 13 4.725,-3.175; 14 4.725,-1.905; 15 4.725,-0.635; 16 4.725,0.635; 17 4.725,1.905; 18 4.725,3.175; 19 4.725,4.445; 20 4.725,5.715
87758-1616 = drill 0.9 pad 1.27: 1 -7,-1; 2 -7,1; 3 -5,-1; 4 -5,1; 5 -3,-1; 6 -3,1; 7 -1,-1; 8 -1,1; 9 1,-1; 10 1,1; 11 3,-1; 12 3,1; 13 5,-1; 14 5,1; 15 7,-1; 16 7,1
87758-2816 = drill 0.9 pad 1.27: 1 -13,-1; 2 -13,1; 3 -11,-1; 4 -11,1; 5 -9,-1; 6 -9,1; 7 -7,-1; 8 -7,1; 9 -5,-1; 10 -5,1; 11 -3,-1; 12 -3,1; 13 -1,-1; 14 -1,1; 15 1,-1; 16 1,1; 17 3,-1; 18 3,1; 19 5,-1; 20 5,1; 21 7,-1; 22 7,1; 23 9,-1; 24 9,1; 25 11,-1; 26 11,1; 27 13,-1; 28 13,1

### Placement (x,y rotation side)
4X4  54,114 0 top
6X5  54,104 0 top
13X6  54,94 0 top
19X7  54,84 0 top
21X8  54,74 0 top
37X9  40,144 0 top
39X10  40,134 0 top
43X11  40,124 0 top
45X12  40,114 0 top
49X13  40,104 0 top
51X14  39.65,94.02 90 top
55X15  39.65,83.96 90 top
57X16  39.65,73.91 90 top
145OUT16  136.95,80.12 90 top
147OUT15  136.95,70.07 90 top
159OUT14  160.95,70.02 90 top
161OUT13  160.95,79.96 90 top
164OUT12  136.95,101.12 90 top
167OUT11  136.95,91.07 90 top
169OUT10  160.95,91.02 90 top
173OUT9  160.95,100.96 90 top
174OUT1  160.95,142.96 90 top
175OUT5  160.95,121.96 90 top
176OUT2  160.95,133.02 90 top
177OUT6  160.95,112.02 90 top
181OUT3  136.95,133.07 90 top
182OUT7  136.95,112.07 90 top
183OUT4  136.95,143.12 90 top
184OUT8  136.95,122.12 90 top
236X1  53.65,144.17 90 top
238X2  53.65,134.12 90 top
240X3  53.65,124.07 90 top
C1  154,147 270 top
C2  154,126 270 top
C3  154,105 270 top
C4  154,84 270 top
J1  48.79,145.21 0 top
J2  48.79,135.16 0 top
J3  48.79,125.11 0 top
J4  34.79,95.05 0 top
J5  34.79,85 0 top
J6  34.79,74.95 0 top
J7  49,115 0 top
J8  49,105 0 top
J9  49,95 0 top
J10  49,85 0 top
J11  49,75 0 top
J12  35,145 0 top
J13  103,147 0 top
J14  35,135 0 top
J15  35,125 0 top
J16  35,115 0 top
J17  35,105 0 top
J18  71,147 0 top
J19  234,0 90 top
J20  108,3 0 top
OJ1  167.04,141.93 0 top
OJ2  167.04,131.98 0 top
OJ3  131.04,132.03 0 top
OJ4  131.04,142.08 0 top
OJ9  131.04,121.08 0 top
OJ10  131.04,111.03 0 top
OJ11  167.04,110.98 0 top
OJ12  167.04,120.93 0 top
OJ13  131.04,100.08 0 top
OJ14  131.04,90.03 0 top
OJ15  167.04,89.98 0 top
OJ16  167.04,99.93 0 top
OJ17  131.04,79.08 0 top
OJ18  131.04,69.03 0 top
OJ19  167.04,68.98 0 top
OJ20  167.04,78.93 0 top
R1  59,144 90 top
R2  59,134 90 top
R3  59,124 90 top
R4  45,94 90 top
R5  45,84 90 top
R6  45,74 90 top
R7  59,114 90 top
R8  59,104 90 top
R9  59,94 90 top
R10  59,84 90 top
R11  59,74 90 top
R12  45,144 90 top
R13  45,134 90 top
R14  45,124 90 top
R15  45,114 90 top
R16  45,104 90 top
R17  106,143 0 top
VSLUE  149,138 0 top
VSLUE2  149,117 0 top
VSLUE3  149,96 0 top
VSLUE4  149,75 0 top
X1  89,75 0 top
X2  105,75 0 top
X13  120,115 270 top
X14  120,87 270 top
X15  94,135 0 top
X16  78,135 0 top
X17  72,87 270 top
X18  72,115 270 top

### Tracks (layer width: path | path; a pad name or v marks a point on that pad's centre or on a via)
3V3  (1 unrouted)
5V  (15 unrouted)
  pour power: -6,164 242,164 242,-8 -6,-8
12V  (1 unrouted)
186OE  (2 unrouted)
  power 0.254: VSLUE4.19 153.5,79.5 152.5,79.5 152,80 152,80.5 144.5,80.5 VSLUE4.1 144.5,81 147,83.5 147,101.5 | 147,101.5 152,101.5 152,101 152.5,100.5 153.5,100.5 VSLUE3.19 | 147,101.5 144.5,101.5 VSLUE3.1 144.5,102 147,104.5 147,122.5 | 147,122.5 152,122.5 152,122 152.5,121.5 153.5,121.5 VSLUE2.19 | 147,122.5 144.5,122.5 VSLUE2.1 144.5,123 147,125.5 147,142.5 | 147,142.5 146.5,142.5 146,143 145.5,143.5 144.5,143.5 VSLUE.1 | 147,142.5 153.5,142.5 VSLUE.19
-12V  (1 unrouted)
GND  (191 unrouted)
  power 0.254: C4.1 154,84.75 155.25,84.75 157.5,82.5 158.25,82.5 161OUT13.3 | C3.1 154,105.75 155.25,105.75 157.5,103.5 158.25,103.5 173OUT9.3 | C2.1 154,126.75 155.25,126.75 157.5,124.5 158.25,124.5 175OUT5.3 | C1.1 154,147.75 155.25,147.75 157.5,145.5 158.25,145.5 174OUT1.3 | VSLUE4.10 144.25,69.25 142.75,67.75 139.5,67.75 147OUT15.5 | VSLUE3.10 144.25,90.25 142.75,88.75 139.5,88.75 167OUT11.5 | VSLUE2.10 144.25,111.25 142.75,109.75 139.5,109.75 182OUT7.5 | VSLUE.10 144.25,132.25 142.75,130.75 139.5,130.75 181OUT3.5
  pour gnd: 235,162 235,-2 -2,-2 -2,162
IO4  (3 unrouted)
IO6  (3 unrouted)
IO13  (3 unrouted)
IO19  (3 unrouted)
IO21  (3 unrouted)
IO37  (3 unrouted)
IO39  (3 unrouted)
IO43  (3 unrouted)
IO45  (3 unrouted)
IO49  (3 unrouted)
IO51  (3 unrouted)
IO55  (3 unrouted)
IO57  (3 unrouted)
IO145_IN4  (1 unrouted)
  power 0.254: VSLUE4.15 153.5,74.5 152,74.5 152,76.5 152.5,77 153.5,77 VSLUE4.17
IO147_IN3  (1 unrouted)
  power 0.254: VSLUE4.11 154,69.5 155.5,69.5 155.5,71 154.5,72 154,72 VSLUE4.13
IO159_IN2  (1 unrouted)
  power 0.254: VSLUE4.8 144.5,72 146,72 146,73.5 145,74.5 144.5,74.5 VSLUE4.6
IO161_IN1  (1 unrouted)
  power 0.254: VSLUE4.4 144,77 142.5,77 142.5,79 143,79.5 144,79.5 VSLUE4.2
IO164_IN4  (1 unrouted)
  power 0.254: VSLUE3.15 153.5,95.5 152,95.5 152,97.5 152.5,98 153.5,98 VSLUE3.17
IO167_IN3  (1 unrouted)
  power 0.254: VSLUE3.11 154,90.5 155.5,90.5 155.5,91.5 155.5,92 154.5,93 154,93 VSLUE3.13
IO169_IN2  (1 unrouted)
  power 0.254: VSLUE3.8 144.5,93 146,93 146,94.5 145,95.5 144.5,95.5 VSLUE3.6
IO173_IN1  (1 unrouted)
  power 0.254: VSLUE3.4 144.5,98 146,98 146,100 145.5,100.5 144.5,100.5 VSLUE3.2
IO174_IN1  (1 unrouted)
  power 0.254: VSLUE.4 144.5,140 146,140 146,142 145.5,142.5 144.5,142.5 VSLUE.2
IO175_IN1  (1 unrouted)
  power 0.254: VSLUE2.4 144.5,119 146,119 146,121 145.5,121.5 144.5,121.5 VSLUE2.2
IO176_IN2  (1 unrouted)
  power 0.254: 143,136 143,137 143.5,137.5 144,137.5 VSLUE.6 | 143,136 143,135 144,135 VSLUE.8 | 143,136 142.5,136
IO177_IN2  (1 unrouted)
  power 0.254: 143,116 143,114 144,114 VSLUE2.8 | 143,116 143.5,116.5 144,116.5 VSLUE2.6 | 143,116 142.5,116
IO181_IN3  (1 unrouted)
  power 0.254: VSLUE.11 154,132.5 155.5,132.5 155.5,134 154.5,135 154,135 VSLUE.13
IO182_IN3  (1 unrouted)
  power 0.254: VSLUE2.11 154,111.5 155.5,111.5 155.5,113 154.5,114 154,114 VSLUE2.13
IO183_IN4  (1 unrouted)
  power 0.254: VSLUE.15 153.5,137.5 152,137.5 152,139.5 152.5,140 153.5,140 VSLUE.17
IO184_IN4  (1 unrouted)
  power 0.254: VSLUE2.15 153.5,116.5 152,116.5 152,118.5 152.5,119 153.5,119 VSLUE2.17
IO185  (2 unrouted)
IO187  (2 unrouted)
IO189  (2 unrouted)
IO195  (2 unrouted)
IO197  (1 unrouted)
IO199  (1 unrouted)
IO201  (1 unrouted)
IO203  (1 unrouted)
IO236  (3 unrouted)
IO238  (3 unrouted)
IO240  (3 unrouted)
OUT1  (1 unrouted)
  power 0.254: 155.5,140.5 155.5,138.5 154,138.5 VSLUE.16 | 155.5,140.5 155,141 154,141 VSLUE.18 | 155.5,140.5 158.5,143.5 160.5,143.5 160.5,143 174OUT1.1
OUT2  (1 unrouted)
  power 0.254: VSLUE.12 153.5,133.5 152,133.5 152,135.5 152.5,136 153.5,136 VSLUE.14 154,136 156.5,136 156.5,135.5 159.5,132.5 160.5,132.5 160.5,133 176OUT2.1
OUT3  (1 unrouted)
  power 0.254: VSLUE.7 144.5,136 145.5,136 146,135.5 146,133.5 144.5,133.5 VSLUE.9 144,133.5 137,133.5 181OUT3.1
OUT4  (1 unrouted)
  power 0.254: 142.5,140.5 142.5,138.5 144,138.5 VSLUE.5 | 142.5,140.5 143,141 144,141 VSLUE.3 | 142.5,140.5 140.5,142.5 137,142.5 137,143 183OUT4.1
OUT5  (1 unrouted)
  power 0.254: 155.5,119.5 155.5,117.5 154,117.5 VSLUE2.16 | 155.5,119.5 155,120 154,120 VSLUE2.18 | 155.5,119.5 158.5,122.5 160.5,122.5 160.5,122 175OUT5.1
OUT6  (1 unrouted)
  power 0.254: VSLUE2.12 153.5,112.5 152,112.5 152,114.5 152.5,115 153.5,115 VSLUE2.14 154,115 156.5,115 156.5,114.5 159.5,111.5 160.5,111.5 160.5,112 177OUT6.1
OUT7  (1 unrouted)
  power 0.254: VSLUE2.7 144.5,115 145.5,115 146,114.5 146,112.5 144.5,112.5 VSLUE2.9 144,112.5 137,112.5 182OUT7.1
OUT8  (1 unrouted)
  power 0.254: 142.5,119.5 142.5,117.5 144,117.5 VSLUE2.5 | 142.5,119.5 143,120 144,120 VSLUE2.3 | 142.5,119.5 140.5,121.5 137,121.5 137,122 184OUT8.1
OUT9  (1 unrouted)
  power 0.254: 155.5,98.5 155.5,96.5 154,96.5 VSLUE3.16 | 155.5,98.5 155,99 154,99 VSLUE3.18 | 155.5,98.5 158.5,101.5 160.5,101.5 160.5,101 173OUT9.1
OUT10  (1 unrouted)
  power 0.254: VSLUE3.12 153.5,91.5 152,91.5 152,93.5 152.5,94 153.5,94 VSLUE3.14 154,94 156.5,94 156.5,93.5 159.5,90.5 160.5,90.5 160.5,91 169OUT10.1
OUT11  (1 unrouted)
  power 0.254: 142.5,91.5 144,91.5 VSLUE3.9 | 142.5,91.5 142.5,93.5 143,94 144,94 VSLUE3.7 | 142.5,91.5 137,91.5 167OUT11.1
OUT12  (1 unrouted)
  power 0.254: 142.5,98.5 142.5,96.5 144,96.5 VSLUE3.5 | 142.5,98.5 143,99 144,99 VSLUE3.3 | 142.5,98.5 140.5,100.5 137,100.5 137,101 164OUT12.1
OUT13  (1 unrouted)
  power 0.254: 155.5,77.5 155.5,75.5 154,75.5 VSLUE4.16 | 155.5,77.5 155,78 154,78 VSLUE4.18 | 155.5,77.5 158.5,80.5 160.5,80.5 160.5,80 161OUT13.1
OUT14  (1 unrouted)
  power 0.254: VSLUE4.12 153.5,70.5 152,70.5 152,72.5 152.5,73 153.5,73 VSLUE4.14 154,73 156.5,73 156.5,72.5 159.5,69.5 160.5,69.5 160.5,70 159OUT14.1
OUT15  (1 unrouted)
  power 0.254: 142.5,70.5 144,70.5 VSLUE4.9 | 142.5,70.5 142.5,72.5 143,73 144,73 VSLUE4.7 | 142.5,70.5 137,70.5 147OUT15.1
OUT16  (1 unrouted)
  power 0.254: VSLUE4.3 144.5,78 145.5,78 146,77.5 146,75.5 144.5,75.5 VSLUE4.5 144,75.5 141.5,75.5 141.5,78 140,79.5 137,79.5 137,80 145OUT16.1

### Text on the board
tPlace: 5V | GND | GND | GND | GND | 3.3V | GND | IO203 | IO201 | IO199 | IO197 | IO195 | IO189 | IO187 | IO185 | GND | 3.3V | 3.3V | GND | GND | 5V | 5V | GND | Waveshare / / CoreEP3C16 / or / CoreEP4CE10 | 12V | GND | --12V | GND | 5V | GND | 5V | GND